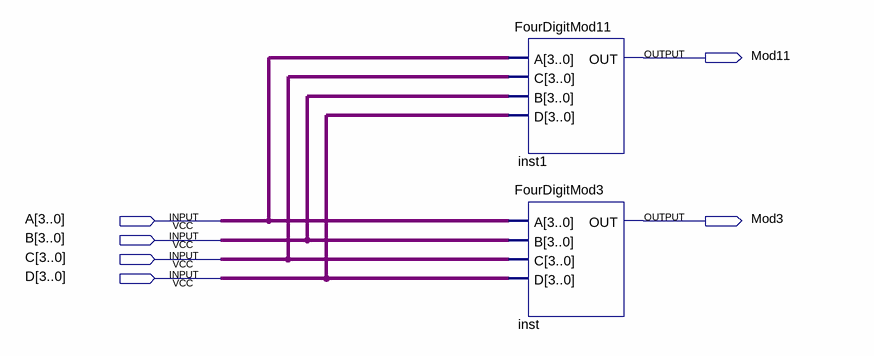
[diagram p0: schematic sheet]
// Quartus schematic Mod.bdf as structural Verilog: 2 symbols, 6 pins
module Mod (
  input  [3:0] A,
  input  [3:0] B,
  input  [3:0] C,
  input  [3:0] D,
  output Mod11,
  output Mod3
);

  FourDigitMod11 inst1 (.A(A), .C(C), .B(B), .D(D), .OUT(Mod11));
  FourDigitMod3 inst (.A(A), .B(B), .C(C), .D(D), .OUT(Mod3));
endmodule
